# EAGLE design Interconnect_board_limit_switches_v1p5 (EAGLE 9.5.1)
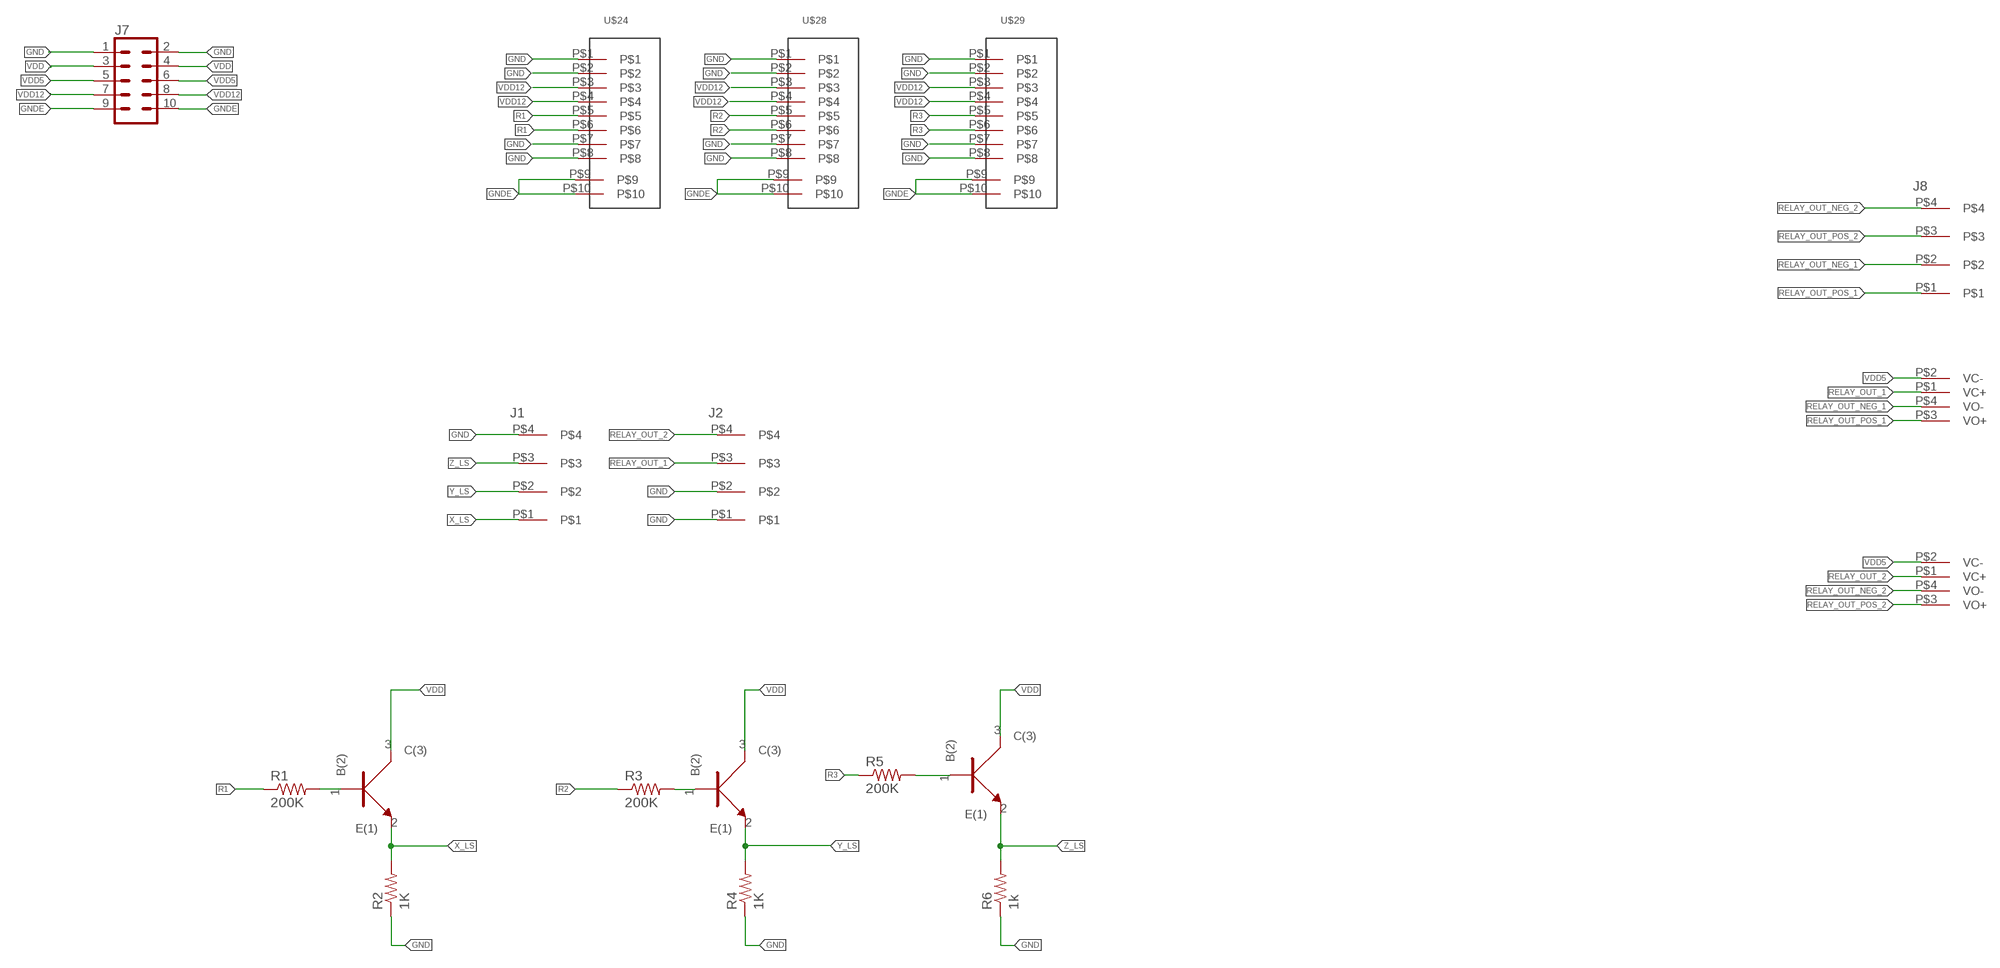
[diagram p0: schematic, sheet 1]

## Parts
J1  3.81MM_1_X_4_RT_ANGLE_PLUG_HEADER  [1X4_3.81MM_PITCH]
J2  3.81MM_1_X_4_RT_ANGLE_PLUG_HEADER  [1X4_3.81MM_PITCH]
J7  CONN_05X2PTH  [2X5]
J8  3.81MM_1_X_4_RT_ANGLE_PLUG_HEADER  [1X4_3.81MM_PITCH]
R1  200K  R_0805  [0805]
R2  1K  R_0805  [0805]
R3  200K  R_0805  [0805]
R4  1K  R_0805  [0805]
R5  200K  R_0805  [0805]
R6  1k  R_0805  [0805]
U1  BC846BW  [SOT323]
U2  BC846BW  [SOT323]
U3  BC846BW  [SOT323]
U$5  RELAY_KYOTO_KF0604D  [RELAY_KYOTO_KF0604D]
U$13  RELAY_KYOTO_KF0604D  [RELAY_KYOTO_KF0604D]
U$24  RJ45_SMTRJ  [RJ45_SMT]
U$28  RJ45_SMTRJ  [RJ45_SMT]
U$29  RJ45_SMTRJ  [RJ45_SMT]

## Nets
GND: J1.P$4 J2.P$1 J2.P$2 J7.1 J7.2 R2.1 R4.1 R6.1 U$24.P$1 U$24.P$2 U$24.P$7 U$24.P$8 U$28.P$1 U$28.P$2 U$28.P$7 U$28.P$8 U$29.P$1 U$29.P$2 U$29.P$7 U$29.P$8
GNDE: J7.9 J7.10 U$24.P$9 U$24.P$10 U$28.P$9 U$28.P$10 U$29.P$9 U$29.P$10
N$1: R1.2 U1.1(B(2))
N$5: R3.2 U2.1(B(2))
N$11: R5.2 U3.1(B(2))
R1: R1.1 U$24.P$5 U$24.P$6
R2: R3.1 U$28.P$5 U$28.P$6
R3: R5.1 U$29.P$5 U$29.P$6
RELAY_OUT_1: J2.P$3 U$5.P$1(VC+)
RELAY_OUT_2: J2.P$4 U$13.P$1(VC+)
RELAY_OUT_NEG_1: J8.P$2 U$5.P$4(VO-)
RELAY_OUT_NEG_2: J8.P$4 U$13.P$4(VO-)
RELAY_OUT_POS_1: J8.P$1 U$5.P$3(VO+)
RELAY_OUT_POS_2: J8.P$3 U$13.P$3(VO+)
VDD: J7.3 J7.4 U1.3(C(3)) U2.3(C(3)) U3.3(C(3))
VDD5: J7.5 J7.6 U$5.P$2(VC-) U$13.P$2(VC-)
VDD12: J7.7 J7.8 U$24.P$3 U$24.P$4 U$28.P$3 U$28.P$4 U$29.P$3 U$29.P$4
X_LS: J1.P$1 R2.2 U1.2(E(1))
Y_LS: J1.P$2 R4.2 U2.2(E(1))
Z_LS: J1.P$3 R6.2 U3.2(E(1))

## Library data of the parts
J1 J2 J8 = 3D_MIG_Controller:3.81MM_1_X_4_RT_ANGLE_PLUG_HEADER
J7 = 3D_MIG_Controller:CONN_05X2: Multi connection point. Often used as Generic Header-pin footprint for 0.1 inch spaced/style header connections For AVR SPI programming port, see special device with nice symbol: "AVR_SPI_PROG_5x2.dev" You can populate with any combo of single row headers, but if you'd like an exact match, check these: 2x5 AVR ICSP Male Header <https://www.sparkfun.com/products/778> (PRT-00778) 2x5 Pin Shrouded Header <https://www.sparkfun.com/products/8506> (PRT-08506) On any of the 0.1 inch spaced packages, you can populate with these: Break Away Headers - Straight <https://www.sparkfun.com/products/116> (PRT-00116) Break Away Male Headers - Right Angle <https://www.sparkfun.com/products/553> (PRT-00553) Female Headers <https://www.sparkfun.com/products/115> (PRT-00115) Break Away Headers - Machine Pin <https://www.sparkfun.com/products/117> (PRT-00117) Break Away Female Headers - Swiss Machine Pin <https://www.sparkfun.com/products/743> (PRT-00743) Special note: the shrouded connector mates well with our 5x2 ribbon cables: 2x5 Pin IDC Ribbon Cable <https://www.sparkfun.com/products/8535> (PRT-08535); PROD_ID: CONN-08499; SF_ID: PRT-0778
R1-R6 = 3D_MIG_Controller:R_0805
U1-U3 = 3D_MIG_Controller:BC846BW; MANUFACTURER_PART_NUMBER: BC846BW; VENDOR: Nexperia
U$5 U$13 = 3D_MIG_Controller:RELAY_KYOTO_KF0604D
U$24 U$28 U$29 = 3D_MIG_Controller:RJ45_SMT

## Board
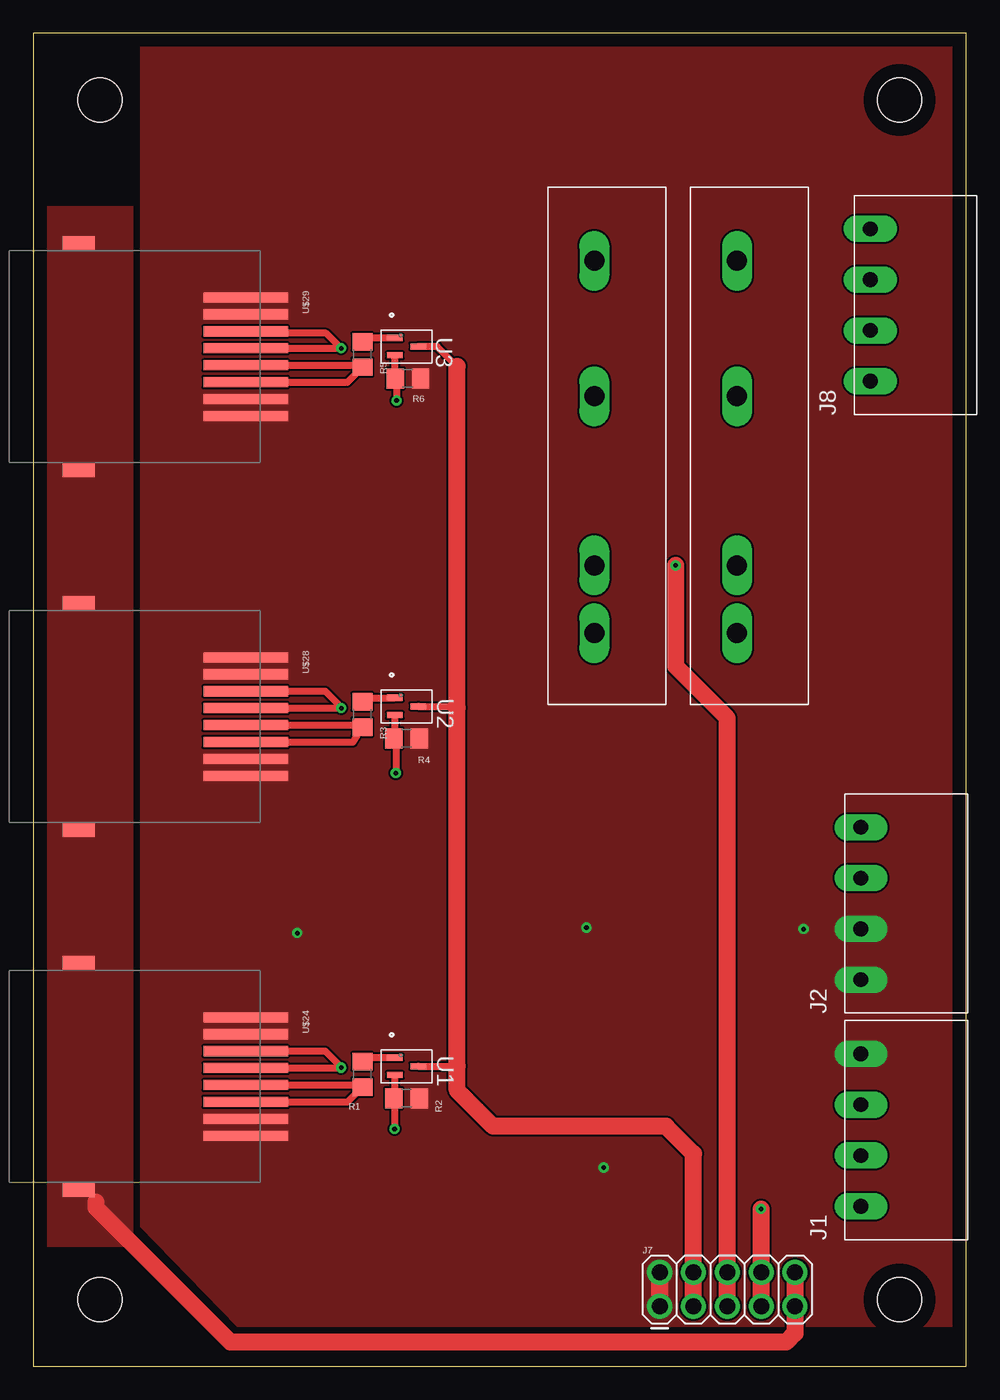
[diagram p1: board, top side]
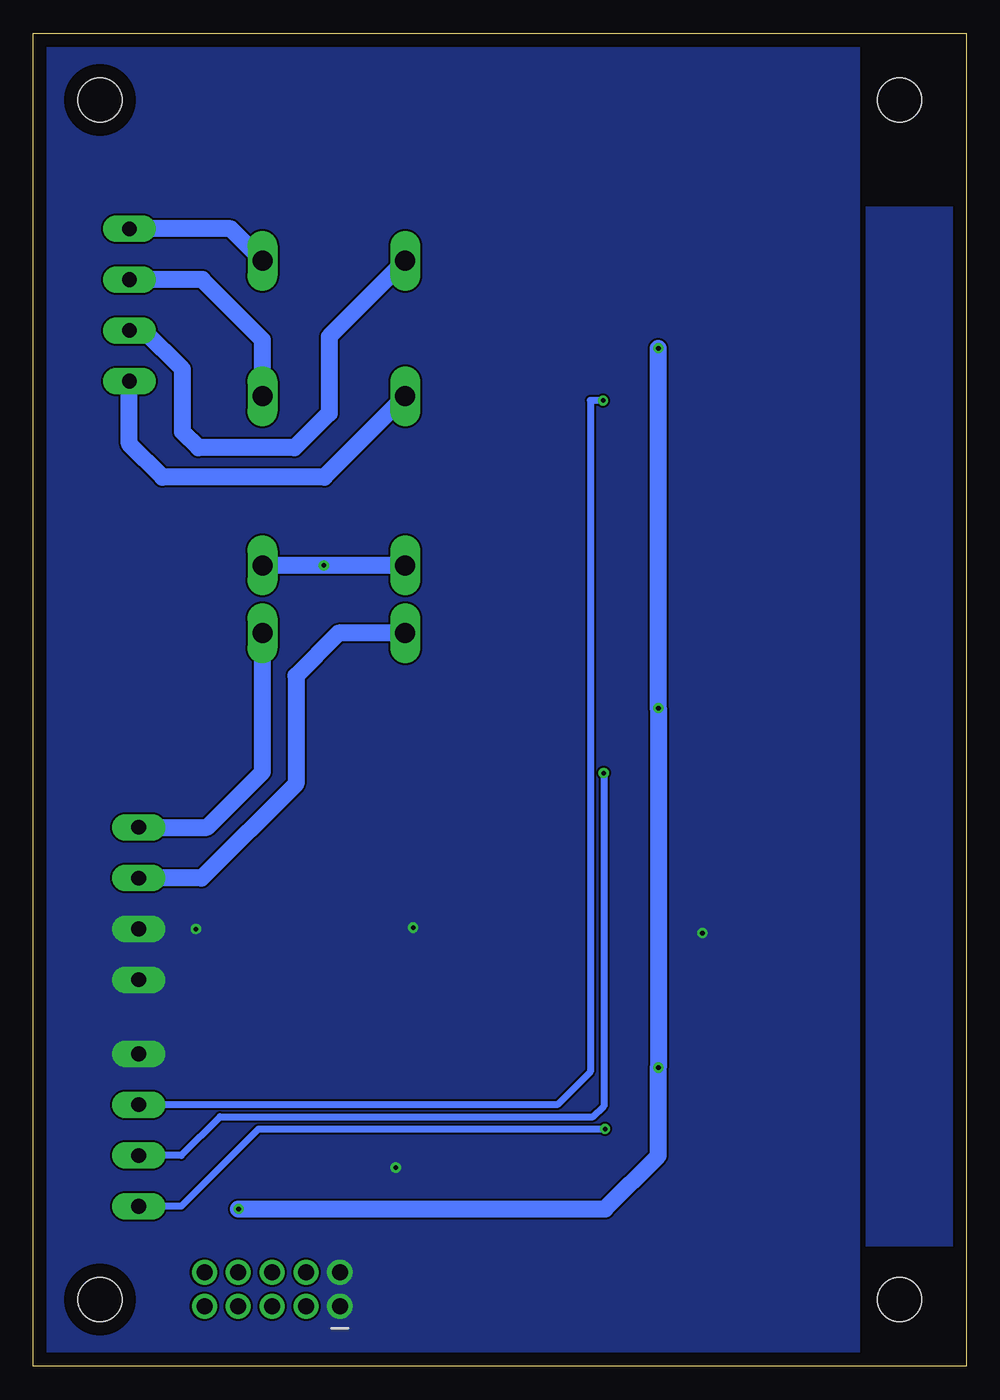
[diagram p2: board, bottom side, seen from below]

Size 70 x 100 mm. Coordinates in mm from the lower left corner, seen from the top.
Outline: 0,0 70,0 70,100 0,100 0,0
Copper layers (1*16): Top 0.035mm / dielectric 1.5mm / Bottom 0.035mm
Design rules "default": minimum track width 6mil, minimum drill 0.35mm, track to track 6mil, track to pad 6mil, pad to pad 6mil, via to via 6mil, smd to smd 6mil, copper to edge 40mil, drill to drill 6mil, minimum pad ring 10mil, minimum via ring 8mil, stop-mask expansion 4mil, vias tented up to drill 0mil, thermal gap 10mil
Holes 3.3 mm at 5,95 5,5 65,5 65,95

### Footprints (pad centres in the part's own frame; a part is rotated, then mirrored left to right if it is on the bottom)
1X4_3.81MM_PITCH = drill 1.1 pad 2 long: P$1 0,0; P$2 3.81,0; P$3 7.62,0; P$4 11.43,0
2X5 = drill 1.2 pad 1.88: 1 0,0; 2 0,2.54; 3 2.54,0; 4 2.54,2.54; 5 5.08,0; 6 5.08,2.54; 7 7.62,0; 8 7.62,2.54; 9 10.16,0; 10 10.16,2.54
0805 = smd 1.3 x 1.5: 1 -0.95,0; 2 0.95,0
SOT323 = smd 0.457 x 1.168: 1 -0.65,-0.876; 2 0.65,-0.876; 3 0,0.876
RELAY_KYOTO_KF0604D = drill 1.5 long: P$1 0,0; P$2 -5.08,0; P$3 -17.78,0; P$4 -27.94,0
RJ45_SMT = smd 0.76 x 6.35: P$1 -3.18,8.94; P$2 -1.91,8.94; P$3 -0.64,8.94; P$4 0.63,8.94; P$5 1.9,8.94; P$6 3.17,8.94; P$7 4.44,8.94; P$8 5.71,8.94 | smd 1.1 x 2.4: P$9 -7.25,-3.6; P$10 9.75,-3.6

### Placement (x,y rotation side)
J1  62.1,12 90 top
J2  62.1,29 90 top
J7  47,4.5 0 top
J8  62.8,73.9 90 top
R1  24.7,21.9 90 top
R2  28,20.1 180 top
R3  24.7,48.9 90 top
R4  28,47.1 180 top
R5  24.7,75.9 90 top
R6  28.1,74.1 180 top
U1  28,22.5 270 top
U2  28,49.5 270 top
U3  28,76.5 270 top
U$5  42.1,55 270 top
U$13  52.8,55 270 top
U$24  7,23 270 top
U$28  7,50 270 top
U$29  7,77 270 top

### Tracks (layer width: path | path; a pad name or v marks a point on that pad's centre or on a via)
GND  (via drill 0.35)
  Top 1.27: J7.1 J7.2
  other vias: 19.8,32.5 41.5,32.9 57.8,32.8 42.8,14.9
  pour Top (no thermals): 8,100 8,10.5 15.3,3 47.6,3 70,3 70,100
  pour Bottom (no thermals): 8,100 70,100 70,-0.4 8,-0.4
GNDE
  Top 1.27: J7.10 J7.9 57.16,2.46 56.5,1.8 14.8,1.8 4.7,11.9 4.7,12.3
  pour Top (no thermals): 7.5,87 0,87 0,9 7.5,9
  pour Bottom (no thermals): 7.5,87 0,87 0,9 7.5,9
N$1
  Top 0.508: U1.1 25,23.15 R1.2
N$5
  Top 0.508: R3.2 25,50.15 U2.1
N$11
  Top 0.508: R5.2 25,77.15 U3.1
R1
  Top 0.508: U$24.P$5 24.55,21.1 R1.1 23.58,19.83 U$24.P$6
R2
  Top 0.508: U$28.P$5 24.15,48.1 R3.1 23.98,46.83 U$28.P$6
R3
  Top 0.508: U$29.P$5 24.55,75.1 R5.1 23.58,73.83 U$29.P$6
RELAY_OUT_1
  Bottom 1.27: U$5.P$1 47.1,55 50.3,51.8 50.3,43.7 57.38,36.62 J2.P$3
RELAY_OUT_2
  Bottom 1.27: J2.P$4 56.97,40.43 52.8,44.6 U$13.P$1
RELAY_OUT_NEG_1
  Bottom 1.27: U$5.P$4 47.8,77.24 47.8,71.5 50.4,68.9 57.6,68.9 58.8,70.1 58.8,74.8 61.71,77.71 J8.P$2
RELAY_OUT_NEG_2
  Bottom 1.27: U$13.P$4 55.19,85.33 J8.P$4
RELAY_OUT_POS_1
  Bottom 1.27: U$5.P$3 48.18,66.7 60.3,66.7 62.8,69.2 J8.P$1
RELAY_OUT_POS_2
  Bottom 1.27: U$13.P$3 52.8,77 57.32,81.52 J8.P$3
VDD
  Top 0.508: 31.8,75 30.3,76.5 U3.3 | U2.3 31.7,49.5 31.8,49.4 | U1.3 31.8,22.5
  Top 1.27: J7.3 J7.4 49.54,15.94 47.48,18 34.5,18 31.8,20.7 31.8,22.5 31.8,49.4 31.8,75
VDD5  (via drill 0.35)
  Top 1.27: v48.2,60.08 48.2,52.5 52.08,48.62 J7.6 J7.5
  Bottom 1.27: U$5.P$2 v48.2,60.08 U$13.P$2
VDD12  (via drill 0.35)
  Top 0.508: U$29.P$3 16.08,77.5 21.97,77.5 v23.1,76.37 U$29.P$4 | U$28.P$4 v23.1,49.37 23.17,49.37 21.9,50.64 U$28.P$3 | U$24.P$4 23.07,22.37 | 23.07,22.37 23.17,22.37 21.9,23.64 U$24.P$3 | v23.1,22.4 23.07,22.37
  Top 1.27: v54.6,11.8 54.62,11.78 J7.8 J7.7
  Bottom 1.27: v54.6,11.8 27.1,11.8 23.1,15.8 v23.1,22.4 v23.1,49.37 v23.1,76.37
X_LS  (via drill 0.35)
  Top 0.508: R2.2 27.1,20.05 | 27.1,20.05 v27.1,17.8 | U1.2 27.12,20.07 27.1,20.05
  Bottom 0.508: J1.P$1 58.9,12 53.1,17.8 v27.1,17.8
Y_LS  (via drill 0.35)
  Top 0.508: v27.2,44.5 27.2,46.95 R4.2 27.12,47.17 U2.2
  Bottom 0.508: v27.2,44.5 27.2,19.5 27.99,18.71 56,18.71 58.9,15.81 J1.P$2
Z_LS  (via drill 0.35)
  Top 0.508: U3.2 27.12,74.13 R6.2 27.25,74 v27.25,72.45
  Bottom 0.508: v27.25,72.45 28.2,72.45 28.2,22.1 30.68,19.62 J1.P$3